# EAGLE design FT232-Breakout (EAGLE 6.3)
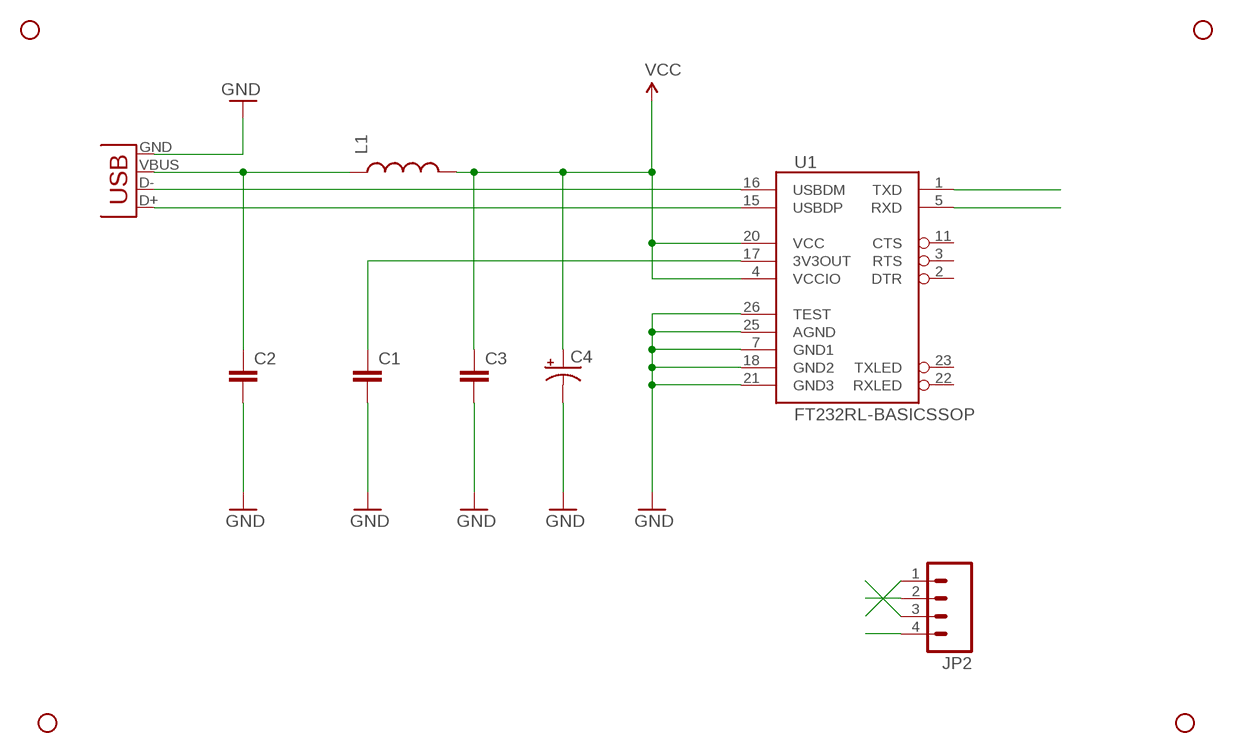
[diagram p0: schematic, sheet 1]

## Parts
C1  CAP0603-CAP  [0603-CAP]
C2  CAP0603-CAP  [0603-CAP]
C3  CAP0603-CAP  [0603-CAP]
C4  CAP_POL1206  [EIA3216]
JP1  USB-B  USBPTH  [USB-B-PTH]
JP2  M04PTH  [1X04]
L1  INDUCTOR0603  [0603]
STANDOFF1  STAND-OFF  [STAND-OFF]
STANDOFF2  STAND-OFF  [STAND-OFF]
STANDOFF3  STAND-OFF  [STAND-OFF]
STANDOFF4  STAND-OFF  [STAND-OFF]
U1  FT232RL-BASICSSOP  [SSOP28DB]

## Nets
GND: C1.2 C2.2 C3.2 C4.C(-) JP1.GND JP2.1 U1.7(GND1) U1.18(GND2) U1.21(GND3) U1.25(AGND) U1.26(TEST)
N$1: C2.1 JP1.VBUS L1.1
N$3: C1.1 U1.17(3V3OUT)
N$4: JP1.D- U1.16(USBDM)
N$5: JP1.D+ U1.15(USBDP)
RX: JP2.2 U1.5(RXD)
TX: JP2.3 U1.1(TXD)
VCC: C3.1 C4.A(+) JP2.4 L1.2 U1.4(VCCIO) U1.20(VCC)
Unconnected: U1.2(DTR) U1.3(RTS) U1.11(CTS) U1.22(RXLED) U1.23(TXLED)

## Library data of the parts
C1-C3 = SparkFun-Passives:CAP: Capacitor Standard 0603 ceramic capacitor, and 0.1" leaded capacitor.
C4 = SparkFun-Passives:CAP_POL: Capacitor Polarized These are standard SMD and PTH capacitors. Normally 10uF, 47uF, and 100uF in electrolytic and tantalum varieties. Always verify the external diameter of the through hole cap, it varies with capacity, voltage, and manufacturer. The EIA devices should be standard.
JP1 = SparkFun-Connectors:USB: USB Connectors USB-B-PTH is fully proven SKU : PRT-00139/CONN-08278 USB-miniB is fully proven SKU : PRT-00587 USB-A-PCB is untested. USB-A-H is throughly reviewed, but untested. Spark Fun Electronics SKU : PRT-00437 USB-B-SMT is throughly reviewed, but untested. Needs silkscreen touching up. USB-A-S has not been used/tested USB-MB-H has not been used/tested USB-MICROB has been used. CONN-09505; PROD_ID: CONN-08278
JP2 = SparkFun-Connectors:M04: Header 4 Standard 4-pin 0.1" header. Use with straight break away headers (SKU : PRT-00116), right angle break away headers (PRT-00553), swiss pins (PRT-00743), machine pins (PRT-00117), and female headers (PRT-00115). Molex polarized connector foot print use with SKU : PRT-08231 with associated crimp pins and housings. 1MM SMD Version SKU: PRT-10208
L1 = SparkFun-Passives:INDUCTOR: Inductors Basic Inductor/Choke - 0603 and 1206. Footprints are not proven and vary greatly between part numbers.
STANDOFF1-STANDOFF4 = SparkFun-Electromechanical:STAND-OFF: #4 Stand Off This is the mechanical footprint for a #4 phillips button head screw. Use the keepout ring to avoid running the screw head into surrounding components. SKU : PRT-00447
U1 = SparkFun-DigitalIC:FT232RL-BASIC: USB UART This is the simplified version of the FT232RL unit. Only what you need, nothing you don't. Spark Fun Electronics SKU : COM-00650

## Board
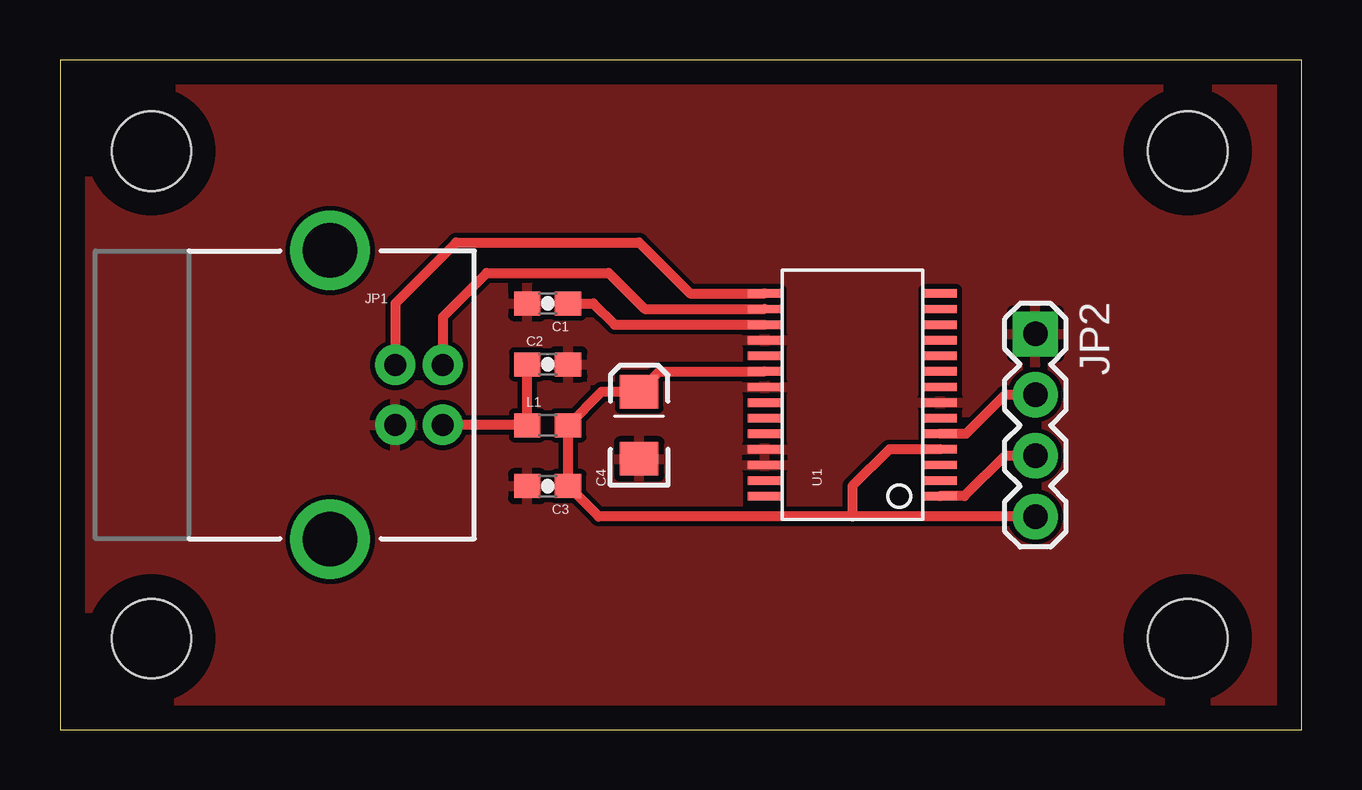
[diagram p1: board, top side]

Size 51.74 x 27.93 mm. Coordinates in mm from the lower left corner, seen from the top.
Outline: 0,0 51.74,0 51.74,27.93 0,27.93 0,0
Copper layers (1*16): Top 0.035mm / dielectric 1.5mm / Bottom 0.035mm
Design rules "default": minimum track width 10mil, minimum drill 24mil, track to track 8mil, track to pad 8mil, pad to pad 8mil, via to via 8mil, smd to smd 8mil, copper to edge 40mil, drill to drill 8mil, minimum pad ring 10mil, minimum via ring 8mil, stop-mask expansion 4mil, vias tented up to drill 0mil, thermal gap 10mil

### Footprints (pad centres in the part's own frame; a part is rotated, then mirrored left to right if it is on the bottom)
0603-CAP = smd 1.1 x 1: 1 -0.85,0; 2 0.85,0
EIA3216 = smd 1.4 x 1.6: A 1.4,0; C -1.4,0
USB-B-PTH = drill 0.914 pad 1.676: D+ 0,1.25; D- 1.981,1.25; GND 0,-1.25; VBUS 1.981,-1.25 | drill 2.286: S1 -2.718,-6.02; S2 -2.718,6.02
1X04 = drill 1.016 pad 1.88 square: 1 0,0 | drill 1.016 pad 1.88: 2 2.54,0; 3 5.08,0; 4 7.62,0
0603 = smd 1.1 x 1: 1 -0.85,0; 2 0.85,0
STAND-OFF = hole 3.302: 0,0
SSOP28DB = smd 0.348 x 1.397: 1 -4.225,-3.656; 2 -3.575,-3.656; 3 -2.925,-3.656; 4 -2.275,-3.656; 5 -1.625,-3.656; 6 -0.975,-3.656; 7 -0.325,-3.656; 8 0.325,-3.656; 9 0.975,-3.656; 10 1.625,-3.656; 11 2.275,-3.656; 12 2.925,-3.656; 13 3.575,-3.656; 14 4.225,-3.656; 15 4.225,3.656; 16 3.575,3.656; 17 2.925,3.656; 18 2.275,3.656; 19 1.625,3.656; 20 0.975,3.656; 21 0.325,3.656; 22 -0.325,3.656; 23 -0.975,3.656; 24 -1.625,3.656; 25 -2.275,3.656; 26 -2.925,3.656; 27 -3.575,3.656; 28 -4.225,3.656

### Placement (x,y rotation side)
C1  20.32,17.78 180 top
C2  20.32,15.24 0 top
C3  20.32,10.16 180 top
C4  24.13,12.7 90 top
JP1  13.97,13.97 0 top
JP2  40.64,16.51 270 top
L1  20.32,12.7 0 top
STANDOFF1  46.99,24.13 0 top
STANDOFF2  46.99,3.81 0 top
STANDOFF3  3.81,3.81 0 top
STANDOFF4  3.81,24.13 0 top
U1  33.02,13.97 90 top

### Tracks (layer width: path | path; a pad name or v marks a point on that pad's centre or on a via)
GND
  pour Top: 0,27.94 52.07,27.94 52.07,0 0,0
N$1
  Top 0.406: C2.1 L1.1 19.45,12.72 JP1.VBUS
N$3
  Top 0.406: C1.1 22.23,17.78 23.11,16.89 U1.17
N$4
  Top 0.406: JP1.D- 15.95,17.22 17.78,19.05 22.86,19.05 24.36,17.55 U1.16
N$5
  Top 0.406: JP1.D+ 13.97,17.78 16.51,20.32 24.13,20.32 26.25,18.2 U1.15
RX
  Top 0.406: JP2.2 39.37,13.97 37.74,12.35 U1.5
TX
  Top 0.406: JP2.3 39.37,11.43 37.69,9.74 U1.1
VCC
  Top 0.406: U1.20 24.98,14.95 C4.A 22.57,14.1 L1.2 C3.1 22.44,8.89 33.02,8.89 | U1.4 34.55,11.7 33.02,10.16 33.02,8.89 | JP2.4 33.02,8.89